# EAGLE design instrumentacion (EAGLE 9.6.2)
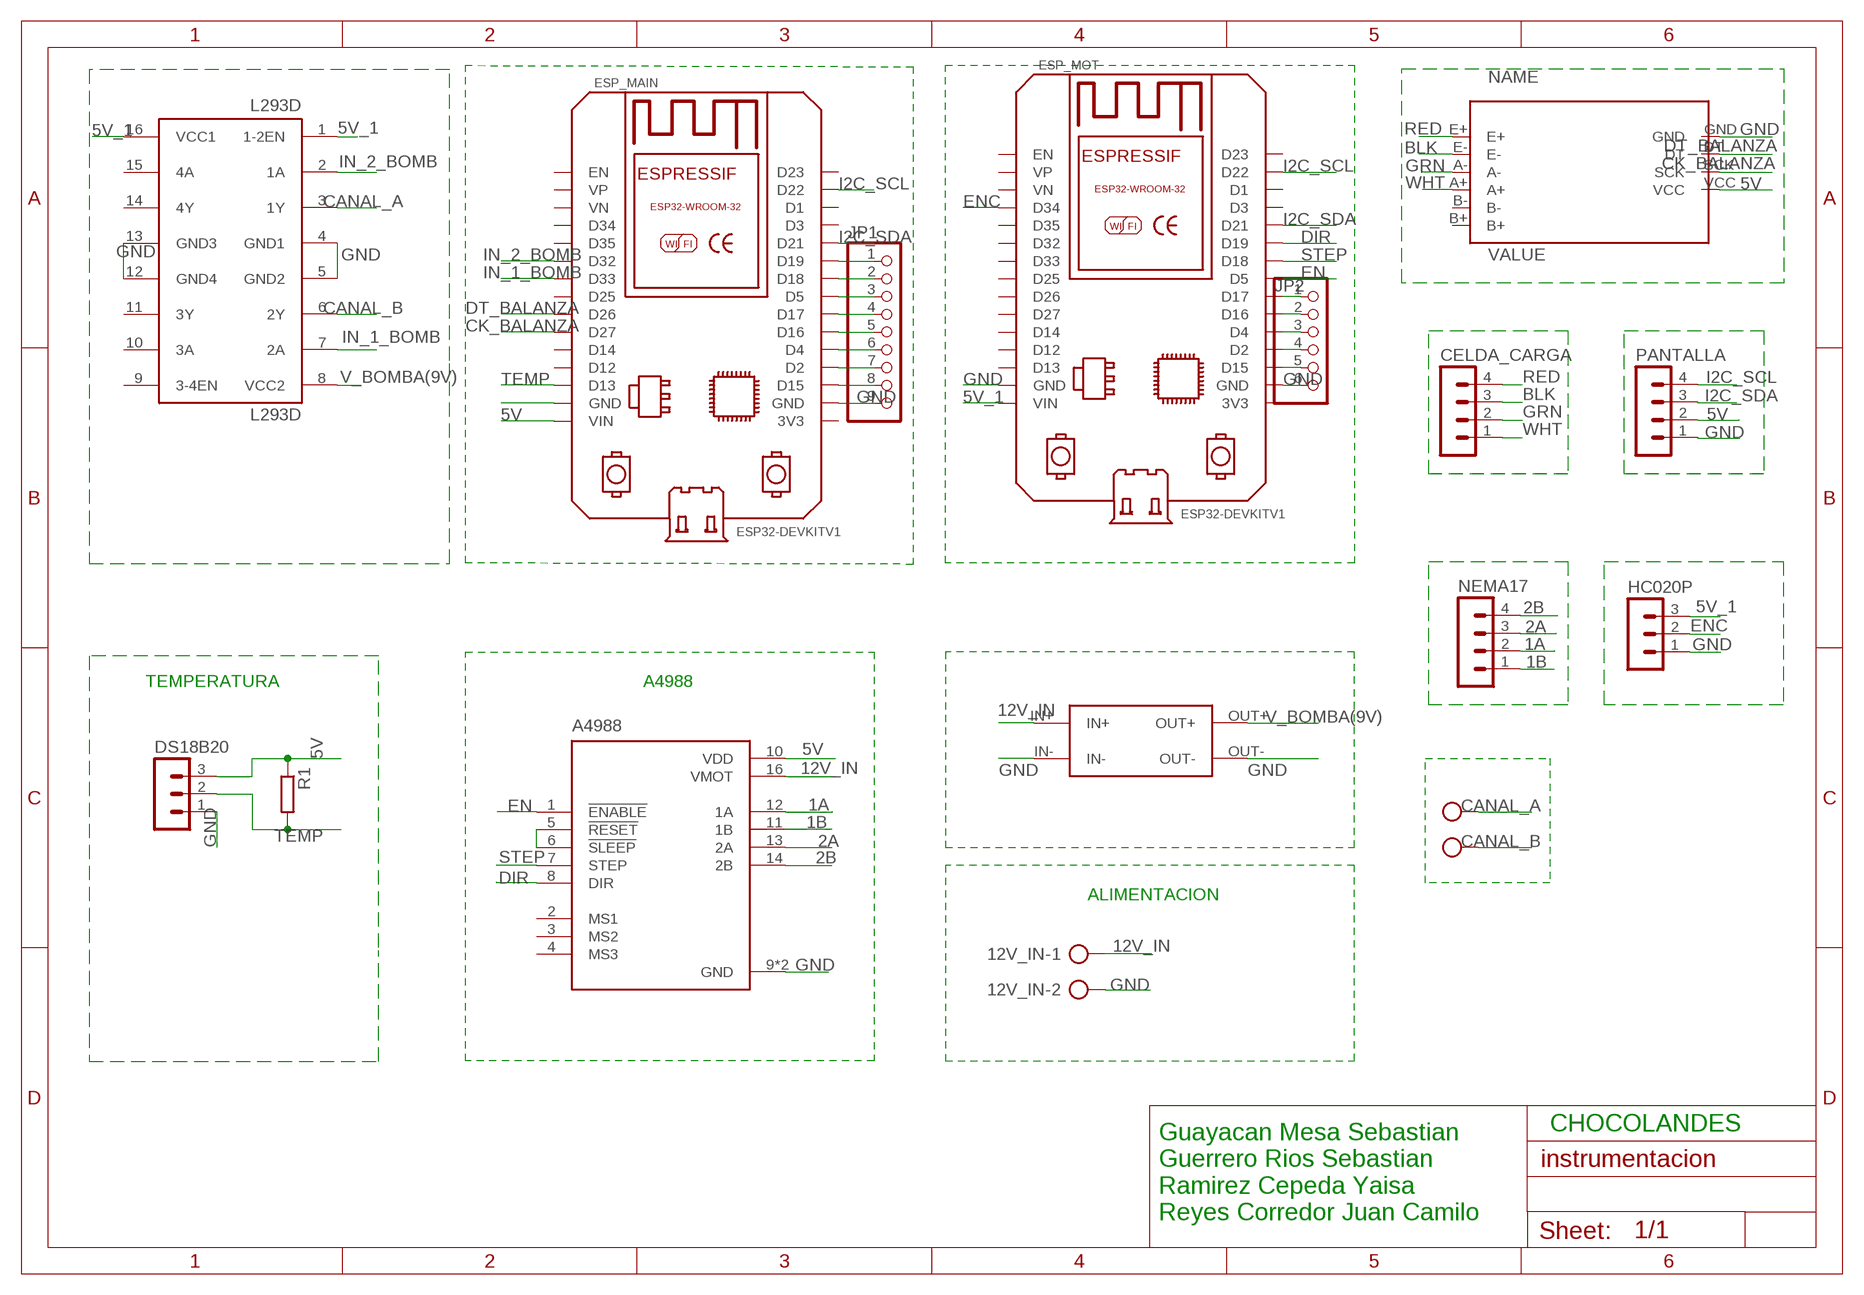
[diagram p0: schematic, sheet 1]

## Parts
12V_IN  SMKDSP_1,5/2  [SMKDSP_1,5/2]
A4988  A4988_STEPPER_MOTOR_DRIVER_CARRIER  [MODULE_A4988_STEPPER_MOTOR_DRIVER_CARRIER]
BOMBA  SMKDSP_1,5/2  [SMKDSP_1,5/2]
CELDA_CARGA  MA04-1  [MA04-1]
DS18B20  MA03-1  [MA03-1]
ESP_MAIN  ESP32DEVKITV1  [ESP32-DEVKITV1]
ESP_MOT  ESP32DEVKITV1  [ESP32-DEVKITV1]
HC020P  MA03-1  [MA03-1]
HX711  HX711A  [HX711]
JP1  PINHD-1X9  [1X09]
JP2  PINHD-1X6  [1X06]
L293D  L293D  [DIL16]
NEMA17  MA04-1  [MA04-1]
PANTALLA  MA04-1  [MA04-1]
R1  R-EU_0204/7  [0204/7]
U$1  LM2596_3A  [LM259_PADS]

## Nets
1A: A4988.12(1A) NEMA17.2
1B: A4988.11(1B) NEMA17.1
2A: A4988.13(2A) NEMA17.3
2B: A4988.14(2B) NEMA17.4
5V: A4988.10(VDD) DS18B20.3 ESP_MAIN.VIN HX711.VCC PANTALLA.2 R1.1
5V_1: ESP_MOT.VIN HC020P.3 L293D.1(1-2EN) L293D.16(VCC1)
12V_IN: 12V_IN.1 A4988.16(VMOT) U$1.IN+
BLK: CELDA_CARGA.3 HX711.E-
CANAL_A: BOMBA.1 L293D.3(1Y)
CANAL_B: BOMBA.2 L293D.6(2Y)
CK_BALANZA: ESP_MAIN.D27 HX711.SCK
DIR: A4988.8(DIR) ESP_MOT.D19
DT_BALANZA: ESP_MAIN.D26 HX711.DT
EN: A4988.1(!ENABLE) ESP_MOT.D5
ENC: ESP_MOT.D34 HC020P.2
GND: 12V_IN.2 A4988.9(GND) A4988.15(GND) DS18B20.1 ESP_MAIN.GND ESP_MAIN.GND@1(GND) ESP_MOT.GND ESP_MOT.GND@1(GND) HC020P.1 HX711.GND JP1.9 JP2.6 L293D.4(GND1) L293D.5(GND2) L293D.12(GND4) L293D.13(GND3) PANTALLA.1 U$1.IN- U$1.OUT-
GRN: CELDA_CARGA.2 HX711.A-
I2C_SCL: ESP_MAIN.D22 ESP_MOT.D22 PANTALLA.4
I2C_SDA: ESP_MAIN.D21 ESP_MOT.D21 PANTALLA.3
IN_1_BOMB: ESP_MAIN.D33 L293D.7(2A)
IN_2_BOMB: ESP_MAIN.D32 L293D.2(1A)
N$14: ESP_MAIN.D19 JP1.1
N$15: ESP_MAIN.D18 JP1.2
N$16: ESP_MAIN.D5 JP1.3
N$17: ESP_MAIN.D17 JP1.4
N$18: ESP_MAIN.D16 JP1.5
N$19: ESP_MAIN.D4 JP1.6
N$20: A4988.5(!RESET) A4988.6(!SLEEP)
N$21: ESP_MAIN.D2 JP1.7
N$22: ESP_MAIN.D15 JP1.8
N$23: ESP_MOT.D17 JP2.1
N$24: ESP_MOT.D16 JP2.2
N$25: ESP_MOT.D4 JP2.3
N$26: ESP_MOT.D2 JP2.4
N$27: ESP_MOT.D15 JP2.5
RED: CELDA_CARGA.4 HX711.E+
STEP: A4988.7(STEP) ESP_MOT.D18
TEMP: DS18B20.2 ESP_MAIN.D13 R1.2
V_BOMBA(9V): L293D.8(VCC2) U$1.OUT+
WHT: CELDA_CARGA.1 HX711.A+
Unconnected: A4988.2(MS1) A4988.3(MS2) A4988.4(MS3) ESP_MAIN.3V3 ESP_MAIN.D1 ESP_MAIN.D3 ESP_MAIN.D12 ESP_MAIN.D14 ESP_MAIN.D23 ESP_MAIN.D25 ESP_MAIN.D34 ESP_MAIN.D35 ESP_MAIN.EN ESP_MAIN.VN ESP_MAIN.VP ESP_MOT.3V3 ESP_MOT.D1 ESP_MOT.D3 ESP_MOT.D12 ESP_MOT.D13 ESP_MOT.D14 ESP_MOT.D23 ESP_MOT.D25 ESP_MOT.D26 ESP_MOT.D27 ESP_MOT.D32 ESP_MOT.D33 ESP_MOT.D35 ESP_MOT.EN ESP_MOT.VN ESP_MOT.VP HX711.B+ HX711.B- L293D.9(3-4EN) L293D.10(3A) L293D.11(3Y) L293D.14(4Y) L293D.15(4A)

## Notes on the sheet
- TEMPERATURA | A4988
- ALIMENTACION
- CHOCOLANDES
- Guayacan Mesa Sebastian 
  Guerrero Rios Sebastian
  Ramirez Cepeda Yaisa
  Reyes Corredor Juan Camilo

## Library data of the parts
12V_IN BOMBA = con-phoenix-smkdsp:SMKDSP_1,5/2: Printklemme, Nennstrom: 17,5 A, Bemessungsspannung: 250 V, Raster: 5,0 mm Source: http://eshop.phoenixcontact.de .. 1733415.pdf; MF: FARNELL; MPN: 1733570; OC_FARNELL: 3041244; OC_NEWARK: 69C8588
A4988 = A4988_STEPPER_MOTOR_DRIVER_CARRIER:A4988_STEPPER_MOTOR_DRIVER_CARRIER: Stepper motor controler; IC: A4988; 1A; Uin mot: 8÷35V Check availability <https://pricing.snapeda.com/parts/A4988%20STEPPER%20MOTOR%20DRIVER%20CARRIER/Pololu/view-part?ref=eda>; AVAILABILITY: Not in stock; DESCRIPTION: Stepper Motor Driver; MF: Pololu; MP: A4988 STEPPER MOTOR DRIVER CARRIER; PACKAGE: None; PRICE: None
CELDA_CARGA NEMA17 PANTALLA = con-lstb:MA04-1: PIN HEADER; OC_FARNELL: unknown; OC_NEWARK: unknown
DS18B20 HC020P = con-lstb:MA03-1: PIN HEADER; OC_FARNELL: unknown; OC_NEWARK: unknown
ESP_MAIN ESP_MOT = ESP32-DEVKITV1:ESP32DEVKITV1: https://github.com/shridattdudhat
HX711 = HX711:HX711
JP1 = pinhead:PINHD-1X9: PIN HEADER
JP2 = pinhead:PINHD-1X6: PIN HEADER
L293D = st-microelectronics:L293D: PUSH-PULL 4 CHANNEL DRIVER; MPN: L293D; OC_FARNELL: 9589619; OC_NEWARK: 56P8249
R1 = rcl:R-EU_: RESISTOR, European symbol; SPICEPREFIX: R
U$1 = Robocol_Eagle_Libraries2:LM2596_3A: LM2596 DC-DC Adjustable PSU Module Reference: LM2596 Type: Buck converter. Description: Buck converte step down regulator with up to 2A. Regulador type: Step down. Rated Current: 2A (3A with heatsink.) Voltage in: 4 to 40VDC Voltage out: 1.23 to 35VDC Efficiency: Up to 92%. Dimensions: 43.6mm x 21mm x 14mm. Author: Franz Luepke. Year: 2021 Made for use in: Robocol Uniandes.

## Board
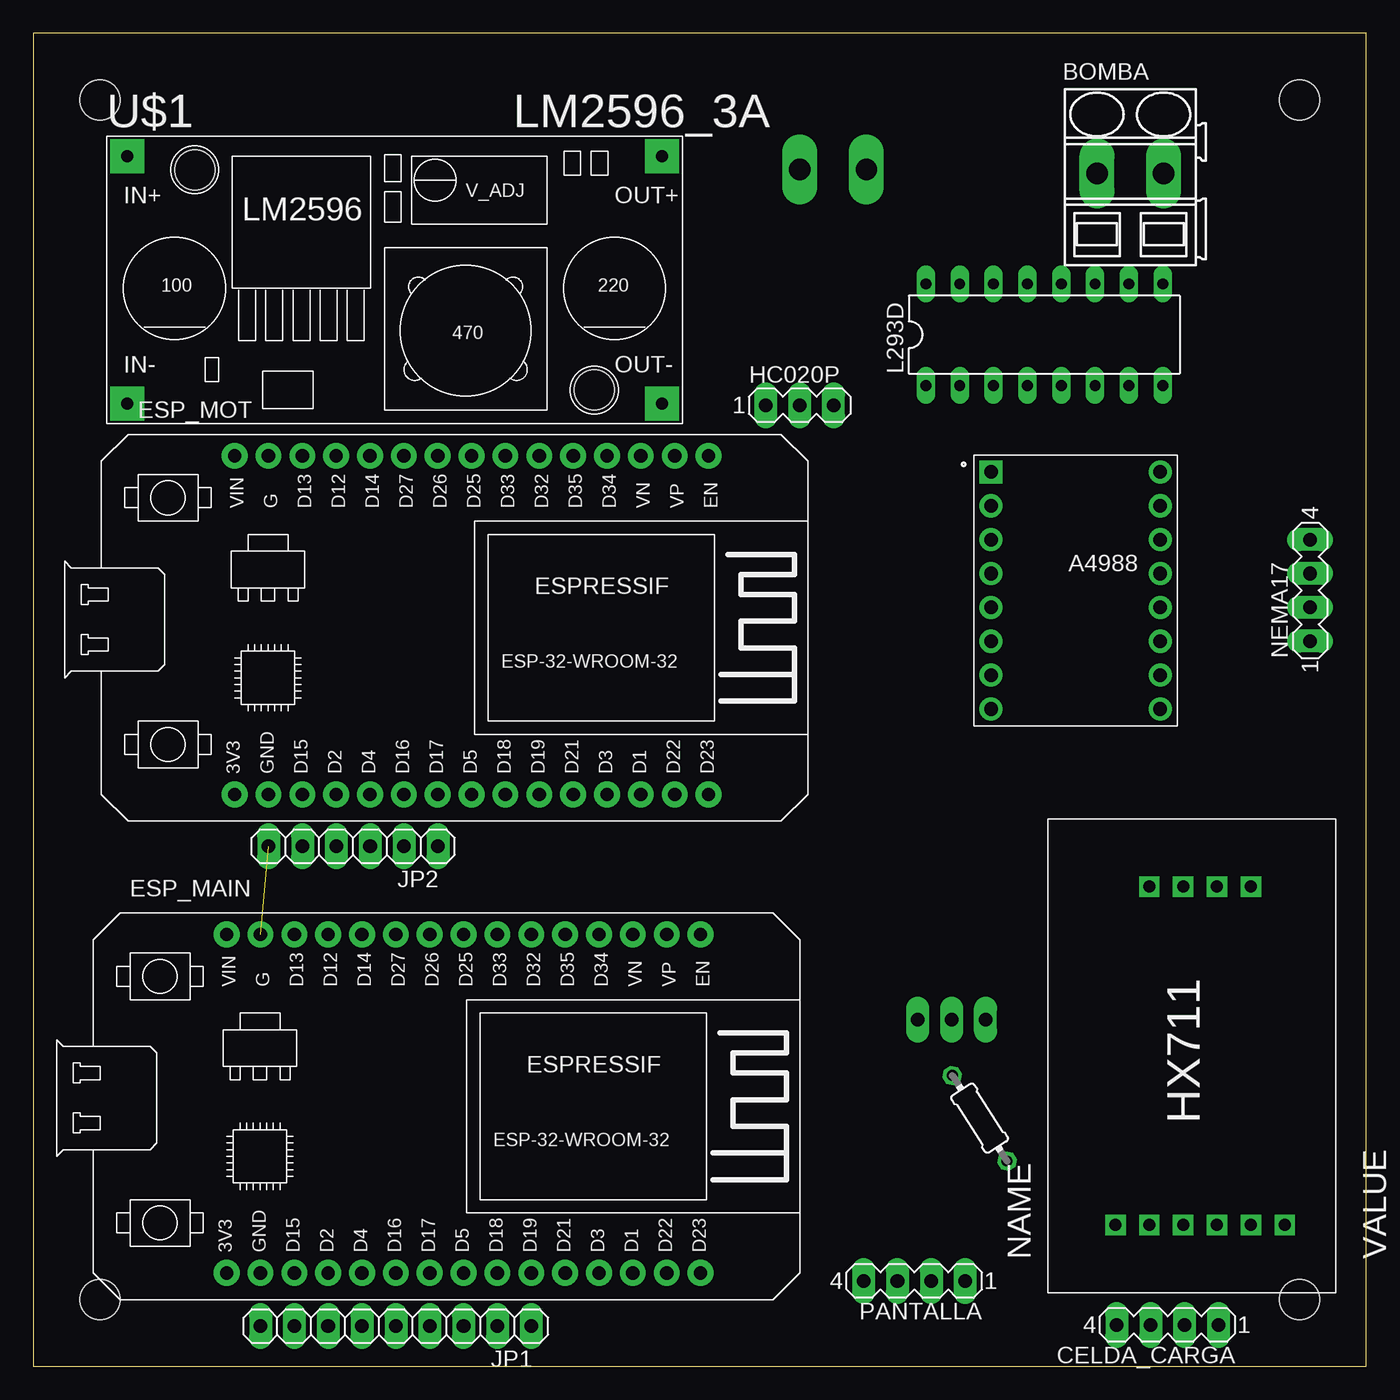
[diagram p1: board, top side]
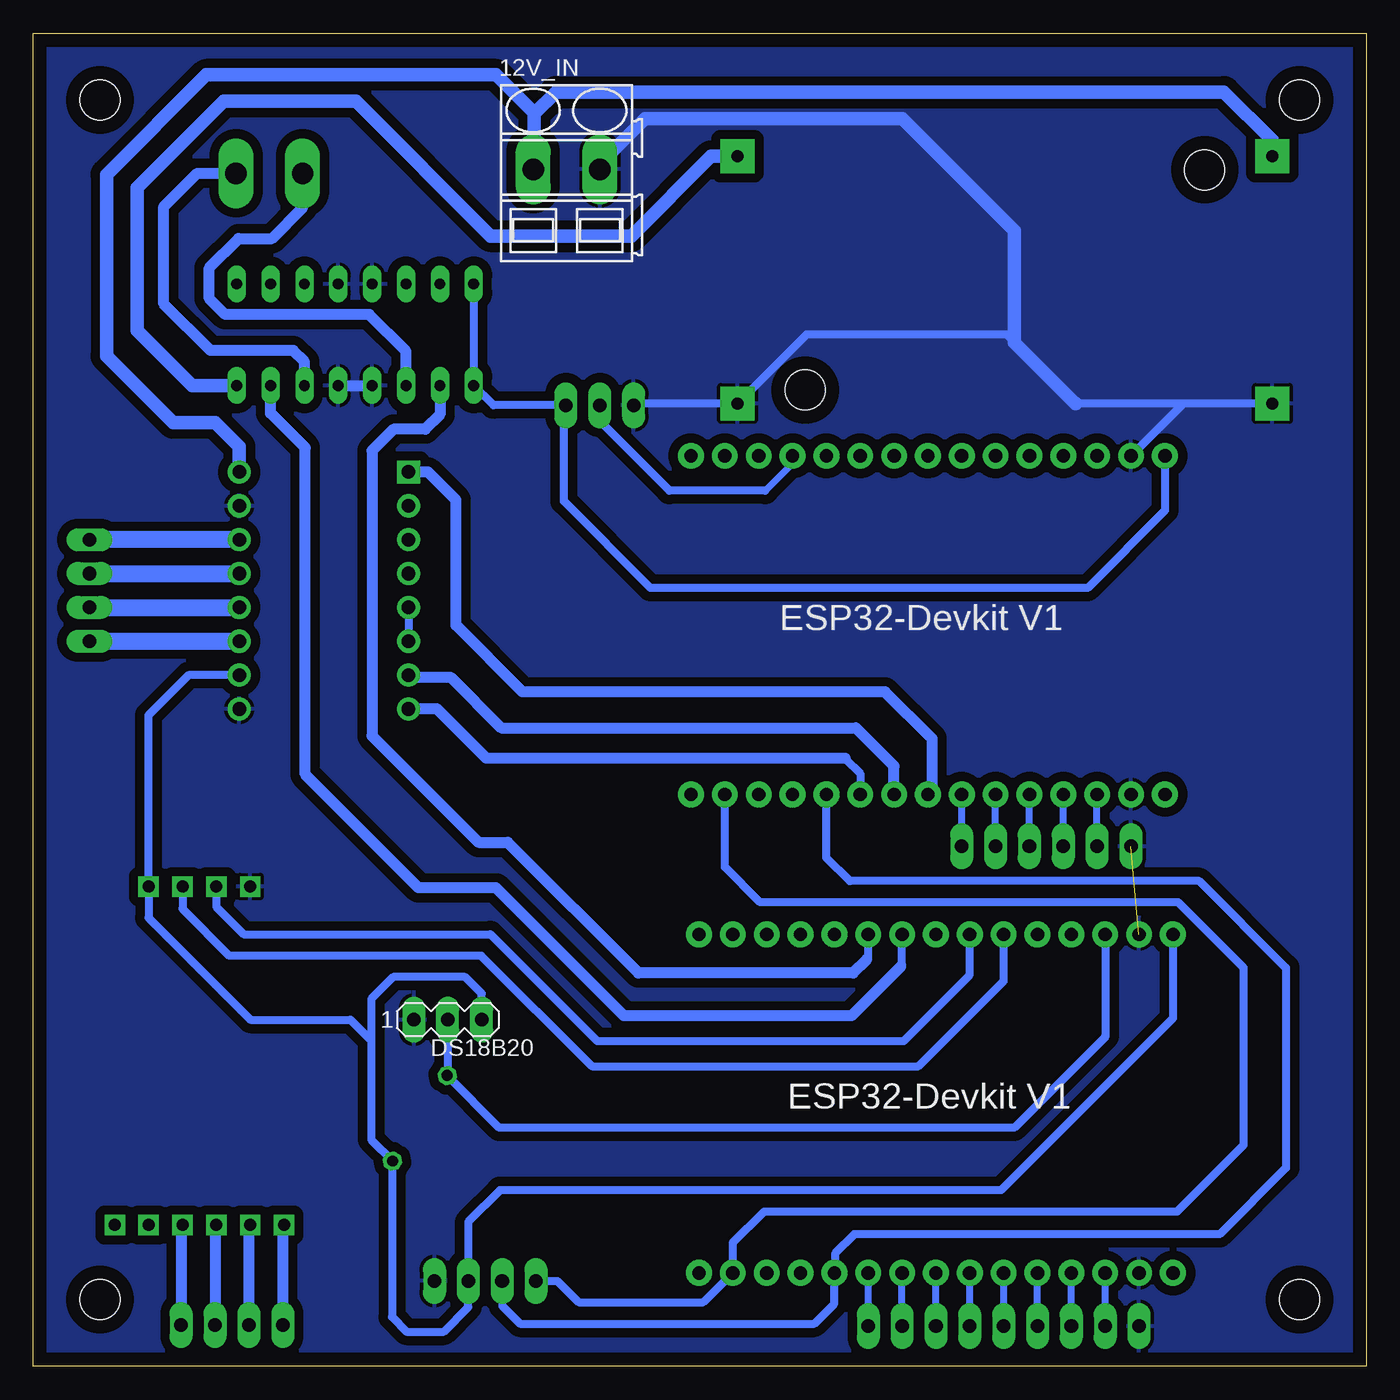
[diagram p2: board, bottom side, seen from below]

Size 100 x 100 mm. Coordinates in mm from the lower left corner, seen from the top.
Outline: 0,0 100,0 100,100 0,100 0,0
Copper layers (1*16): Top 0.035mm / dielectric 1.5mm / Bottom 0.035mm
Design rules "default *": minimum track width 6mil, minimum drill 0.35mm, track to track 0.7mm, track to pad 0.5mm, pad to pad 0.5mm, via to via 0.5mm, smd to smd 0.5mm, copper to edge 40mil, drill to drill 6mil, minimum pad ring 10mil, minimum via ring 8mil, stop-mask expansion 4mil, vias tented up to drill 0mil, thermal gap 10mil
Holes 3 mm at 95,95 95,5 5,95 5,5

### Footprints (pad centres in the part's own frame; a part is rotated, then mirrored left to right if it is on the bottom)
SMKDSP_1,5/2 = drill 1.6 pad 1.8 long: 1 -2.5,0; 2 2.5,0
MODULE_A4988_STEPPER_MOTOR_DRIVER_CARRIER = drill 1.02 square: 1 -6.35,8.89 | drill 1.02: 2 -6.35,6.35; 3 -6.35,3.81; 4 -6.35,1.27; 5 -6.35,-1.27; 6 -6.35,-3.81; 7 -6.35,-6.35; 8 -6.35,-8.89; 9 6.35,-8.89; 10 6.35,-6.35; 11 6.35,-3.81; 12 6.35,-1.27; 13 6.35,1.27; 14 6.35,3.81; 15 6.35,6.35; 16 6.35,8.89
MA04-1 = drill 1.016 long: 1 -3.81,0; 2 -1.27,0; 3 1.27,0; 4 3.81,0
MA03-1 = drill 1.016 long: 1 -2.54,0; 2 0,0; 3 2.54,0
ESP32-DEVKITV1 = drill 1 pad 1.93: 3V3 0,0; D1 30.48,0; D2 7.62,0; D3 27.94,0; D4 10.16,0; D5 17.78,0; D12 7.62,25.4; D13 5.08,25.4; D14 10.16,25.4; D15 5.08,0; D16 12.7,0; D17 15.24,0; D18 20.32,0; D19 22.86,0; D21 25.4,0; D22 33.02,0; D23 35.56,0; D25 17.78,25.4; D26 15.24,25.4; D27 12.7,25.4; D32 22.86,25.4; D33 20.32,25.4; D34 27.94,25.4; D35 25.4,25.4; EN 35.56,25.4; GND 2.54,25.4; GND@1 2.54,0; VIN 0,25.4; VN 30.48,25.4; VP 33.02,25.4
HX711 = drill 0.9 square: A+ 8.89,21.59; A- 8.89,24.13; B+ 8.89,16.51; B- 8.89,19.05; DT 34.29,24.13; E+ 8.89,29.21; E- 8.89,26.67; GND 34.29,26.67; SCK 34.29,21.59; VCC 34.29,19.05
1X09 = drill 1.016 long: 1 -10.16,0; 2 -7.62,0; 3 -5.08,0; 4 -2.54,0; 5 0,0; 6 2.54,0; 7 5.08,0; 8 7.62,0; 9 10.16,0
1X06 = drill 1.016 long: 1 -6.35,0; 2 -3.81,0; 3 -1.27,0; 4 1.27,0; 5 3.81,0; 6 6.35,0
DIL16 = drill 0.813 long: 1 -8.89,-3.81; 2 -6.35,-3.81; 3 -3.81,-3.81; 4 -1.27,-3.81; 5 1.27,-3.81; 6 3.81,-3.81; 7 6.35,-3.81; 8 8.89,-3.81; 9 8.89,3.81; 10 6.35,3.81; 11 3.81,3.81; 12 1.27,3.81; 13 -1.27,3.81; 14 -3.81,3.81; 15 -6.35,3.81; 16 -8.89,3.81
0204/7 = drill 0.813 octagon: 1 -3.81,0; 2 3.81,0
LM259_PADS = drill 0.9 pad 2.54 square: IN+ -20.066,9.271; IN- -20.066,-9.271; OUT+ 20.066,9.271; OUT- 20.066,-9.271 | hole 3: -14.986,8.255; 14.986,-8.255

### Placement (x,y rotation side)
12V_IN  60,89.8 0 bottom
A4988  78.2,58.2 0 top
BOMBA  82.3,89.5 0 top
CELDA_CARGA  85.1,3.1 180 top
DS18B20  68.9,26 0 bottom
ESP_MAIN  14.5,7 0 top
ESP_MOT  15.1,42.9 0 top
HC020P  57.5,72.1 0 top
HX711  110.4,1.7 90 top
JP1  27.2,3 180 top
JP2  24,39 180 top
L293D  75.85,77.39 0 top
NEMA17  95.8,58.2 90 top
PANTALLA  66.1,6.4 180 top
R1  71,18.6 122.6 top
U$1  27.1,81.5 0 top

### Tracks (layer width: path | path; a pad name or v marks a point on that pad's centre or on a via)
1A
  Bottom 1.27: NEMA17.2 A4988.12
1B
  Bottom 1.27: NEMA17.1 A4988.11
2A
  Bottom 1.27: NEMA17.3 A4988.13
2B
  Bottom 1.27: A4988.14 NEMA17.4
5V
  Bottom 0.61: A4988.10 88.35,51.85 91.35,48.85 HX711.VCC 91.35,33.65 83.7,26 76.2,26 74.65,24.45 | DS18B20.3 66.36,27.96 67.6,29.2 73,29.2 74.65,27.55 74.65,24.45 | 74.65,24.45 74.65,16.99 R1.1 73.1,15.34 73.1,3.7 72,2.6 69.2,2.6 67.37,4.43 PANTALLA.2 67.37,10.83 65,13.2 27.4,13.2 14.5,26.1 ESP_MAIN.VIN
5V_1
  Bottom 0.61: HC020P.3 60.2,72.1 | 60.2,72.1 65.48,72.1 L293D.1 L293D.16 | 60.2,72.1 60.2,64.9 53.7,58.4 20.9,58.4 15.1,64.2 ESP_MOT.VIN
12V_IN
  Bottom 1.016: U$1.IN+ 7.03,91.97 10.66,95.6 60.8,95.6 62.45,93.95 | A4988.16 84.55,68.99 86.35,70.79 89.49,70.79 94.5,75.8 94.5,89.4 87.02,96.88 65.28,96.88 62.45,94.05 62.45,93.95 | 12V_IN.1 62.45,89.85 62.45,93.95
BLK
  Bottom 0.813: HX711.E- 83.83,10.49 CELDA_CARGA.3
CANAL_A
  Bottom 0.813: L293D.3 72.04,76.14 74.8,78.9 85.6,78.9 86.8,80.1 86.8,82.4 84.6,84.6 82.1,84.6 79.8,86.9 BOMBA.1
CANAL_B
  Bottom 0.813: L293D.6 79.66,75.36 80.5,76.2 86.7,76.2 90.2,79.7 90.2,87 87.7,89.5 BOMBA.2
CK_BALANZA
  Bottom 0.61: HX711.SCK 88.81,34.31 85.3,30.8 66.4,30.8 58.1,22.5 33.6,22.5 27.2,28.9 ESP_MAIN.D27
DIR
  Bottom 0.61: 39.1,45.6 37.96,44.46 ESP_MOT.D19
  Bottom 0.813: A4988.8 69.71,49.31 66,45.6 39.1,45.6
DT_BALANZA
  Bottom 0.61: HX711.DT 86.27,34.47 84.2,32.4 65.7,32.4 57.7,24.4 34.7,24.4 29.74,29.36 ESP_MAIN.D26
EN
  Bottom 0.813: A4988.1 70.39,67.09 68.3,65 68.3,55.6 63.3,50.6 36.1,50.6 32.58,47.08 32.58,43.2 ESP_MOT.D5
ENC
  Bottom 0.508: ESP_MOT.D34 43.04,67.72 45.08,65.68
  Bottom 0.61: 45.08,65.68 52.28,65.68 57.5,70.9 HC020P.2
GND  (1 unrouted)
  Bottom 0.61: HC020P.1 54.83,72.23 U$1.OUT- 41.97,77.43 27,77.43 21.8,72.23 U$1.IN- 13.71,72.23 ESP_MOT.GND
  Bottom 0.813: L293D.5 L293D.4
  Bottom 1.016: 12V_IN.2 57.5,90.2 54.1,93.6 34.8,93.6 26.4,85.2 26.4,76.8 21.83,72.23 21.8,72.23
  pour Bottom: 99.7,0.4 99.7,99.6 97.2,99.6 0.5,99.6 0.5,91.6 0.5,0.4
GRN
  Bottom 0.813: HX711.A- 86.37,10.49 CELDA_CARGA.2
I2C_SCL
  Bottom 0.61: PANTALLA.4 60.69,6.4 59.09,4.8 49.72,4.8 ESP_MAIN.D22 47.52,9.23 47.53,9.24 45.17,11.6 14.2,11.6 9.2,16.6 9.2,29.9 14.1,34.8 45.47,34.8 48.12,37.45 ESP_MOT.D22
I2C_SDA
  Bottom 0.61: PANTALLA.3 64.83,4.53 63.5,3.2 41.4,3.2 39.9,4.7 ESP_MAIN.D21 39.81,7.09 39.81,8.49 38.4,9.9 11,9.9 6.02,14.88 6.02,29.9 12.52,36.4 38.75,36.4 40.5,38.15 ESP_MOT.D21
IN_1_BOMB
  Bottom 0.61: 34.93,29.97 34.82,30.08 ESP_MAIN.D33
  Bottom 0.813: 34.93,29.97 38.61,26.29 55.69,26.29 65.3,35.9 71.1,35.9 79.6,44.4 79.6,68.9 82.2,71.5 L293D.7
IN_2_BOMB
  Bottom 0.61: 37.47,30.53 37.36,30.64 ESP_MAIN.D32
  Bottom 0.813: 37.47,30.53 38.5,29.5 54.6,29.5 64.4,39.3 66.6,39.3 74.6,47.3 74.6,68.68 72.98,70.3 70.6,70.3 69.5,71.4 L293D.2
N$14
  Bottom 0.508: JP1.1 ESP_MAIN.D19
N$15
  Bottom 0.508: JP1.2 ESP_MAIN.D18
N$16
  Bottom 0.508: JP1.3 ESP_MAIN.D5
N$17
  Bottom 0.508: JP1.4 ESP_MAIN.D17
N$18
  Bottom 0.508: JP1.5 ESP_MAIN.D16
N$19
  Bottom 0.508: JP1.6 ESP_MAIN.D4
N$20
  Bottom 0.61: A4988.5 A4988.6
N$21
  Bottom 0.508: ESP_MAIN.D2 22.15,6.97 22.12,6.94 JP1.7
N$22
  Bottom 0.508: ESP_MAIN.D15 19.61,6.97 19.58,6.94 JP1.8
N$23
  Bottom 0.508: JP2.1 ESP_MOT.D17
N$24
  Bottom 0.508: JP2.2 ESP_MOT.D16
N$25
  Bottom 0.508: JP2.3 ESP_MOT.D4
N$26
  Bottom 0.508: JP2.4 ESP_MOT.D2
N$27
  Bottom 0.508: JP2.5 ESP_MOT.D15
RED
  Bottom 0.813: HX711.E+ 81.29,10.49 CELDA_CARGA.4
STEP
  Bottom 0.813: A4988.7 71.7,51.7 68.7,51.7 64.9,47.9 38.3,47.9 35.42,45.02 ESP_MOT.D18
TEMP
  Bottom 0.61: ESP_MAIN.D13 19.58,24.78 19.55,24.75 26.4,17.9 65.04,17.9 R1.2 68.9,21.86 DS18B20.2
V_BOMBA(9V)
  Bottom 1.016: L293D.8 88.08,73.58 92.2,77.7 92.2,88.4 85.7,94.9 75.8,94.9 65.7,84.8 55.14,84.8 49.17,90.77 U$1.OUT+
WHT
  Bottom 0.813: HX711.A+ 88.91,10.49 CELDA_CARGA.1